# EAGLE design ac-adapter (EAGLE 9.6.2)
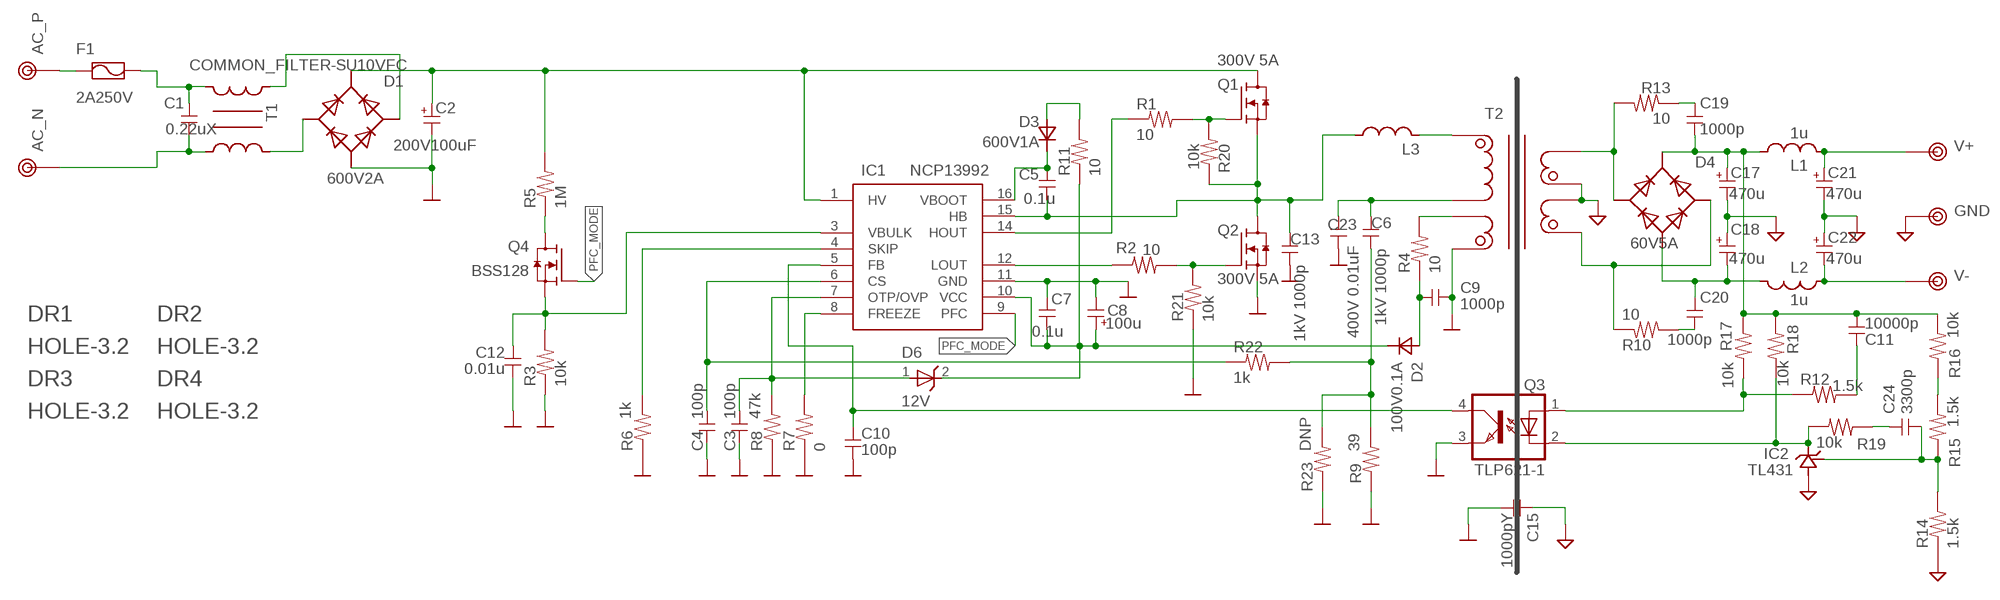
[diagram p0: schematic, sheet 1]

## Parts
C1  0.22uX  C-X  [X-CAPACITER]
C2  200V100uF  CPOLE7.5-16A2  [E5-16A2]
C3  100p  C-1608  [1608]
C4  100p  C-1608  [1608]
C5  0.1u  C-1608  [1608]
C6  1kV 1000p  C-5  [C050]
C7  0.1u  C-1608  [1608]
C8  100u  CPOLE2.5-6.5  [E2.5-6.5]
C9  1000p  C-1608  [1608]
C10  100p  C-1608  [1608]
C11  10000p  C-1608  [1608]
C12  0.01u  C-1608  [1608]
C13  1kV 1000p  C-5  [C050]
C15  1000pY  C-Y  [Y-CAPACITER]
C17  470u  CPOLE5-10  [E5-10]
C18  470u  CPOLE5-10  [E5-10]
C19  1000p  C-1608  [1608]
C20  1000p  C-1608  [1608]
C21  470u  CPOLE5-10  [E5-10]
C22  470u  CPOLE5-10  [E5-10]
C23  400V 0.01uF  C-12.5  [C125]
C24  3300p  C-1608  [1608]
D1  600V2A  DIODE4-GBU8A  [GBU8A]
D2  100V0.1A  DIODE-1N4148W  [SOD123]
D3  600V1A  DIODE-7  [D0204/7]
D4  60V5A  DIODE4-RBA406B  [RBA-406]
D6  12V  ZENER-SMD  [SOD123]
DR1  HOLE-3.2  [HOLE_3.2]
DR2  HOLE-3.2  [HOLE_3.2]
DR3  HOLE-3.2  [HOLE_3.2]
DR4  HOLE-3.2  [HOLE_3.2]
F1  2A250V  FUSE-5  [FUSE-5]
IC1  NCP13992  [SO16-NCP13992]
IC2  TL431  [TO-92]
L1  1u  L-5  [L5-7,5]
L2  1u  L-5  [L5-7,5]
L3  L-PQ20  [BPQ20/20]
Q1  300V 5A  NMOS  [TO-220]
Q2  300V 5A  NMOS  [TO-220]
Q3  TLP621-1  [DIL04]
Q4  BSS128  NMOS-SMD  [SC59]
R1  10  R-2012  [2012]
R2  10  R-2012  [2012]
R3  10k  R-1608  [1608]
R4  10  R-1608  [1608]
R5  1M  R-7.5  [0204/7]
R6  1k  R-1608  [1608]
R7  0  R-1608J  [1608-J]
R8  47k  R-1608  [1608]
R9  39  R-1608  [1608]
R10  10  R-2012  [2012]
R11  10  R-1608  [1608]
R12  1.5k  R-1608  [1608]
R13  10  R-2012  [2012]
R14  1.5k  R-1608  [1608]
R15  1.5k  R-1608  [1608]
R16  10k  R-1608  [1608]
R17  10k  R-1608  [1608]
R18  10k  R-1608  [1608]
R19  10k  R-1608  [1608]
R20  10k  R-1608  [1608]
R21  10k  R-1608  [1608]
R22  1k  R-1608  [1608]
R23  DNP  R-1608  [1608]
T1  COMMON_FILTER-SU10VFC  [SU10VFC]
T2  TRANSFORMAER_FLYBACK-PQ2620  [BPQ26/20-1112CPFR]
TP1  AC_P  TESTPIN-BIG  [TESTPIN-BIG]
TP2  AC_N  TESTPIN-BIG  [TESTPIN-BIG]
TP3  V+  TESTPIN-BIG  [TESTPIN-BIG]
TP4  V-  TESTPIN-BIG  [TESTPIN-BIG]
TP5  GND  TESTPIN-BIG  [TESTPIN-BIG]

## Nets
GND: C15.1 C17.- C18.+ C21.- C22.+ IC2.2(GND) R14.1 T2.9(L3_P) T2.10(L4_N) TP5.1
N$1: C1.1 F1.2 T1.2
N$2: Q1.1(G) R1.2 R20.1
N$3: C19.1 R13.1
N$4: D1.3(AC2) T1.1
N$5: D1.2(AC1) T1.4
N$6: R15.2 R16.1
N$7: C18.- C20.1 D4.4(V-) L2.2
N$8: C6.1 C23.1 T2.3(L1_N)
N$9: Q2.1(G) R2.1 R21.2
N$10: C20.2 R10.2
N$11: L3.6 T2.1(L1_P)
N$12: IC1.8(FREEZE) R7.2
N$13: C3.1 D6.1(A) IC1.7(OTP/OVP) R8.2
N$14: C4.1 IC1.6(CS) R22.1
N$15: IC1.4(SKIP) R6.2
N$16: IC1.14(HOUT) R1.1
N$17: IC1.12(LOUT) R2.2
N$18: C5.1 D3.2(K) IC1.16(VBOOT)
N$19: C12.1 IC1.3(VBULK) Q4.2(S) R3.2
N$20: C10.1 IC1.5(FB) Q3.4(COL)
N$21: Q4.3(D) R5.1
N$22: R4.2 T2.6(L2_N)
N$23: C11.1 R12.2
N$24: C9.1 D2.1(A) R4.1
N$25: D3.1(A) R11.2
N$26: C1.2 T1.3 TP2.1
N$27: C6.2 R9.2 R22.2 R23.2
N$29: IC2.3(OUT) Q3.2(C) R18.1 R19.1
N$32: C24.2 IC2.1(REF) R14.2 R15.1
N$33: C24.1 R19.2
N$34: Q3.1(A) R12.1 R17.2
N$35: D4.2(AC1) R13.2 T2.7(L3_N) T2.8(L3_N)
N$36: D4.3(AC2) R10.1 T2.11(L4_P) T2.12(L4_P)
N$37: F1.1 TP1.1
N$40: C11.2 C17.+ C19.2 D4.1(V+) L1.2 R16.2 R17.1 R18.2
PFC_MODE: IC1.9(PFC) Q4.1(G)
PGND: C2.- C3.2 C4.2 C7.2 C8.- C9.2 C10.2 C12.2 C13.2 C15.2 C23.2 D1.4(V-) IC1.11(GND) Q2.3(S) Q3.3(EMIT) R3.1 R6.1 R7.1 R8.1 R9.1 R21.1 R23.1 T2.5(L2_P)
SW: C5.2 C13.1 IC1.15(HB) L3.4 Q1.3(S) Q2.2(D) R20.2
V+: C21.+ L1.1 TP3.1
V-: C22.- L2.1 TP4.1
VCC: C7.1 C8.+ D2.2(K) D6.2(C) IC1.10(VCC) R11.1
VH: C2.+ D1.1(V+) IC1.1(HV) Q1.2(D) R5.2

## Library data of the parts
C1 C3-C7 C9-C13 C15 C19 C20 C23 C24 = my_rcl:C
C2 C8 C17 C18 C21 C22 = my_rcl:CPOL
D1 D4 = my_rcl:DIODE4
D2 D3 = my_rcl:DIODE
D6 = my_rcl:ZENER
DR1-DR4 = my_connector:HOLE-3.2
F1 = my_rcl:FUSE
IC1 = my_ic:NCP13992
IC2 = my_ic:TL431
L1-L3 = my_rcl:L
Q1 Q2 Q4 = my_ic:NMOS
Q3 = my_ic:TLP621-1: Photocoupler
R1-R23 = my_rcl:R
T1 = my_rcl:COMMON_FILTER
T2 = my_rcl:TRANSFORMAER_FLYBACK
TP1-TP5 = my_connector:TESTPIN

## Board
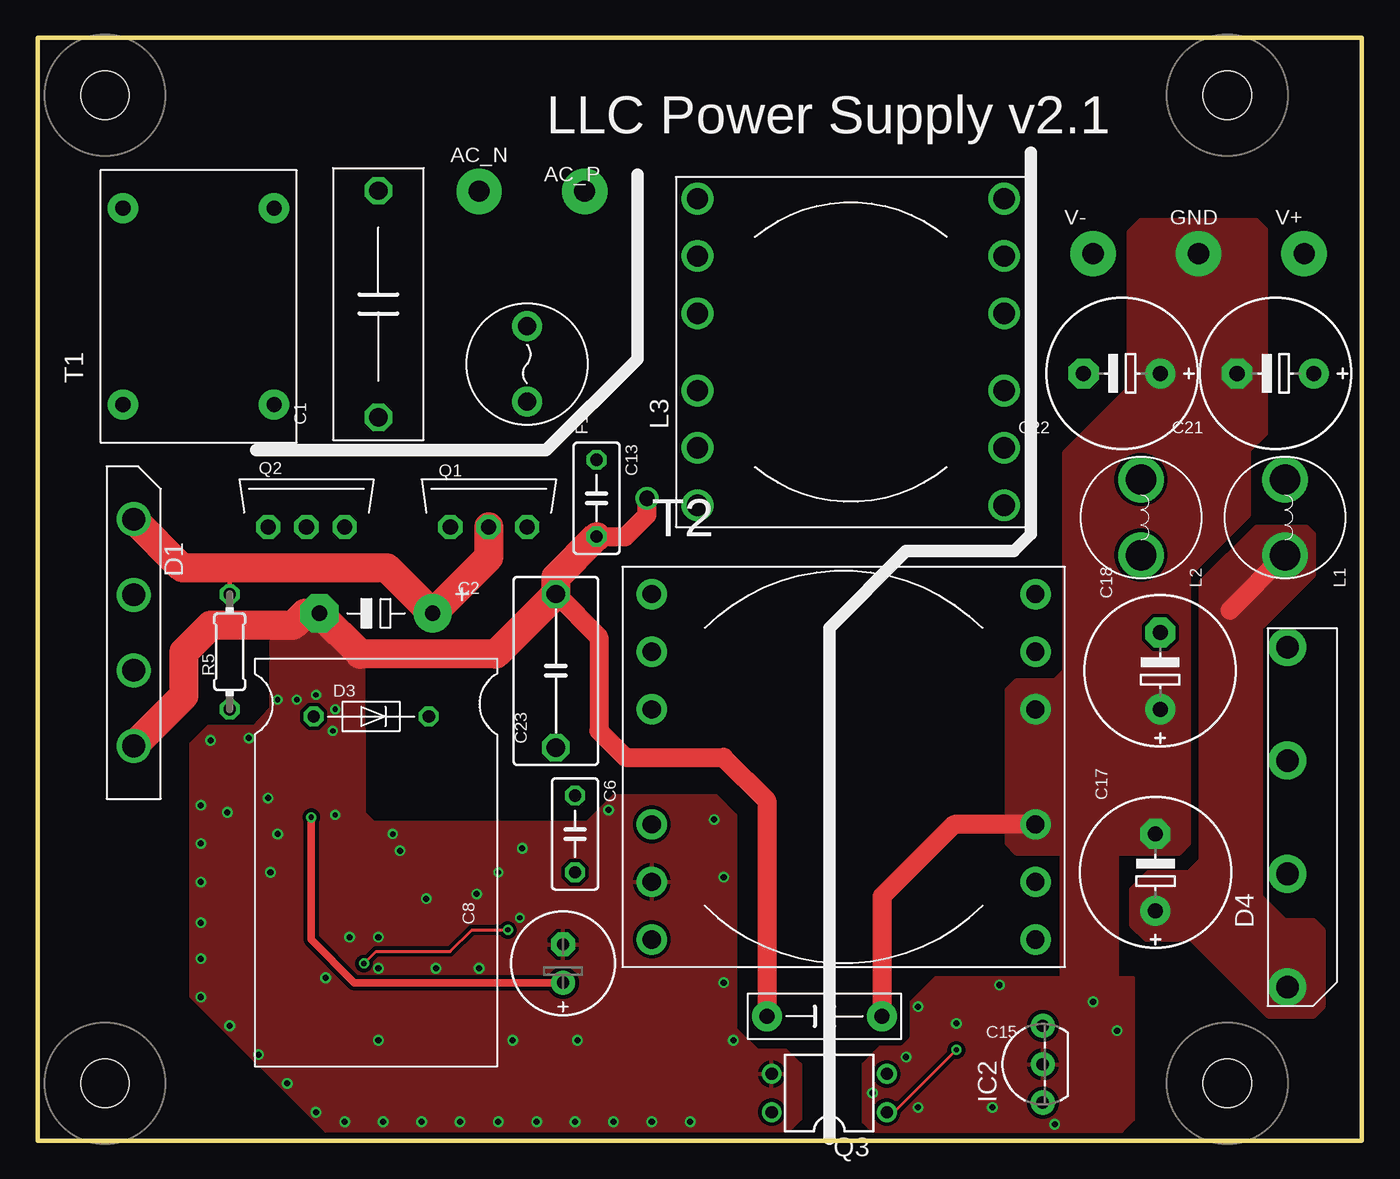
[diagram p1: board, top side]
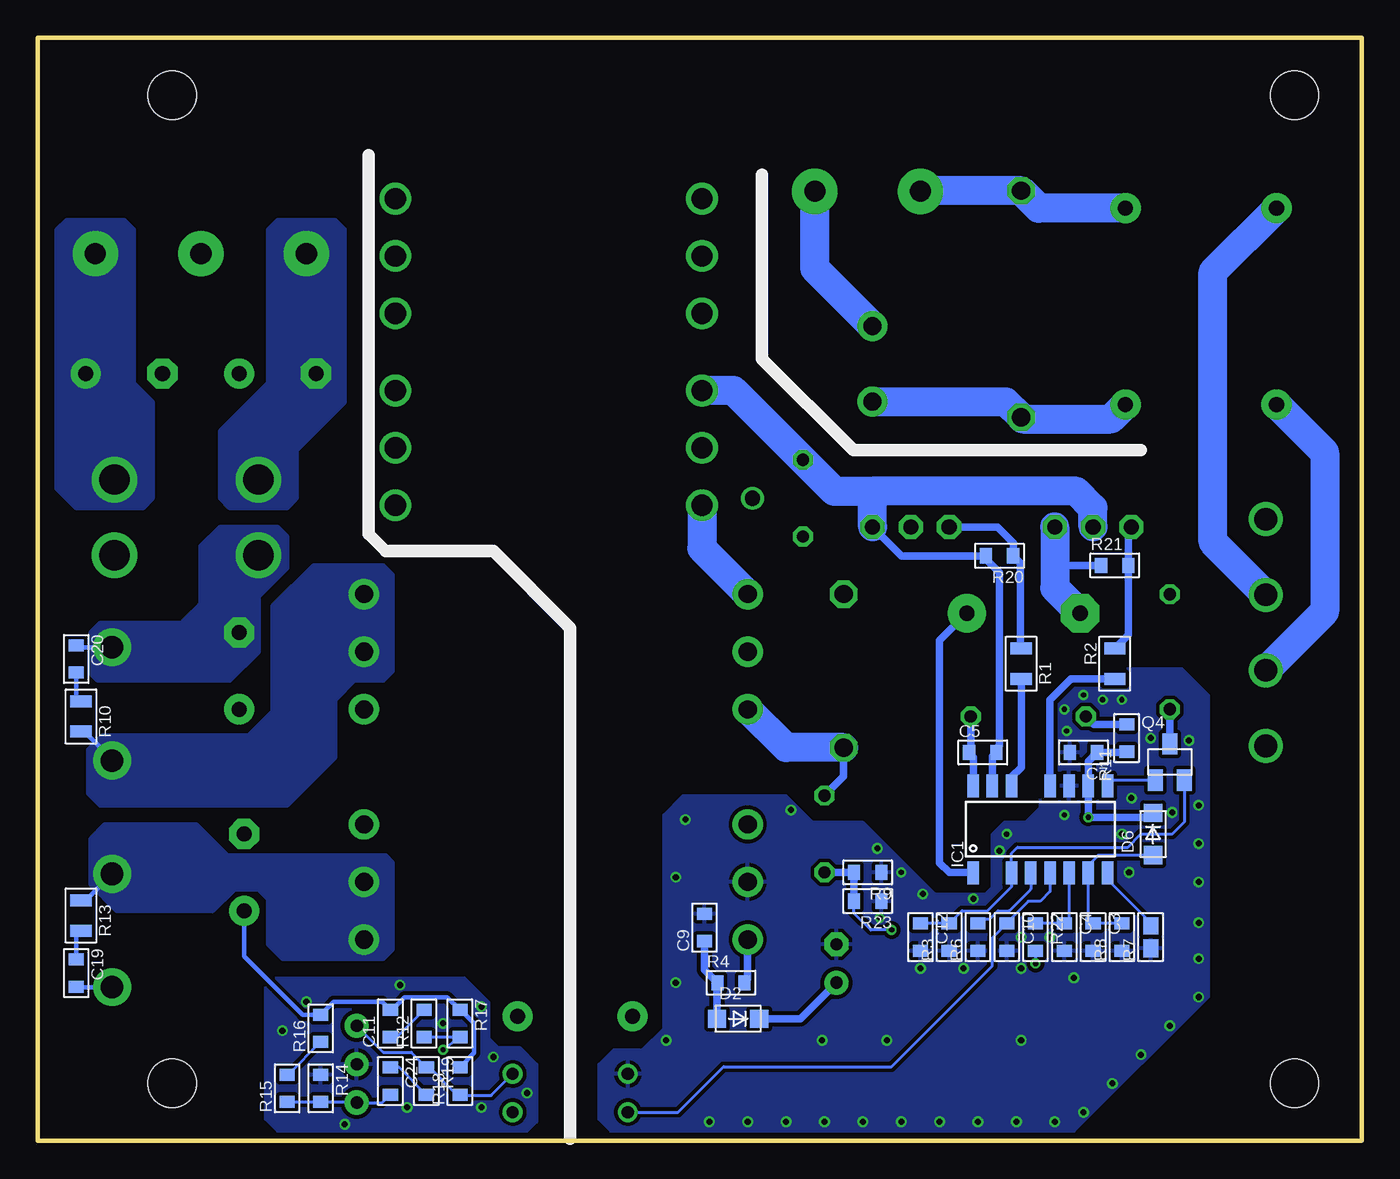
[diagram p2: board, bottom side, seen from below]

Size 87.63 x 73.03 mm. Coordinates in mm from the lower left corner, seen from the top.
Outline: 0,73.03 0,0 87.63,0 87.63,73.03 0,73.03
Copper layers (1*16): Top 0.035mm / dielectric 1.5mm / Bottom 0.035mm
Design rules "SeeedStudio_2layer_DRU_20140221 *": minimum track width 6mil, minimum drill 0.3mm, track to track 8mil, track to pad 8mil, pad to pad 8mil, via to via 12mil, smd to smd 0mil, copper to edge 0.3mm, drill to drill 10mil, minimum pad ring 0.25mm, minimum via ring 6mil, stop-mask expansion 2mil, vias tented up to drill 1mm, thermal gap 10mil
bRestrict: 1 lines

### Footprints (pad centres in the part's own frame; a part is rotated, then mirrored left to right if it is on the bottom)
X-CAPACITER = drill 1.2 octagon: 1 -7.5,0; 2 7.5,0
E5-16A2 = drill 1.016 pad 2.54: + 3.75,0 | drill 1.016 pad 2.54 octagon: - -3.75,0
1608 = smd 0.8 x 1: 1 -0.9,0; 2 0.9,0
C050 = drill 0.813 octagon: 1 -2.54,0; 2 2.54,0
E2.5-6.5 = drill 0.813 pad 1.6: + -1.27,0 | drill 0.813 pad 1.6 octagon: - 1.27,0
Y-CAPACITER = drill 1 pad 2: 1 -3.81,0; 2 3.81,0
E5-10 = drill 1 pad 2: + -2.54,0 | drill 1 pad 2 octagon: - 2.54,0
C125 = drill 1.2 octagon: 1 -5.08,0; 2 5.08,0
GBU8A = drill 1.5: 1 -7.5,0; 2 -2.5,0; 3 2.5,0; 4 7.5,0
SOD123 = smd 1.2 x 1.2: 1 -1.4,0; 2 1.4,0
D0204/7 = drill 0.813 octagon: 1 -3.81,0; 2 3.81,0
RBA-406 = drill 1.5 pad 2.5: 1 -11.25,0; 2 -3.75,0; 3 3.75,0; 4 11.25,0
HOLE_3.2 = hole 3.2: 0,0
FUSE-5 = drill 1.2 pad 2: 1 -2.5,0; 2 2.5,0
SO16-NCP13992 = smd 0.762 x 1.524: 1 -4.445,-2.875; 3 -1.905,-2.875; 4 -0.635,-2.875; 5 0.635,-2.875; 6 1.905,-2.875; 7 3.175,-2.875; 8 4.445,-2.875; 9 4.445,2.875; 10 3.175,2.875; 11 1.905,2.875; 12 0.635,2.875; 14 -1.905,2.875; 15 -3.175,2.875; 16 -4.445,2.875
TO-92 = drill 0.813 pad 1.6: 1 -2.54,0; 2 0,0; 3 2.54,0
L5-7,5 = drill 2 pad 3: 1 -2.5,0; 2 2.5,0
BPQ20/20 = drill 1.4: 1 -10.15,10.15; 2 -10.15,6.35; 3 -10.15,2.55; 4 -10.15,-2.55; 5 -10.15,-6.35; 6 -10.15,-10.15; 7 10.15,-10.15; 8 10.15,-6.35; 9 10.15,-2.55; 10 10.15,2.55; 11 10.15,6.35; 12 10.15,10.15
TO-220 = drill 1 pad 1.6 octagon: 1 -2.54,0; 2 0,0; 3 2.54,0
DIL04 = drill 0.813: 1 -1.27,-3.81; 2 1.27,-3.81; 3 1.27,3.81; 4 -1.27,3.81
SC59 = smd 1 x 1.4: 1 -0.95,-1.2; 2 0.95,-1.2; 3 0,1.2
2012 = smd 0.8 x 1.4: 1 -1,0; 2 1,0
0204/7 = drill 0.813 octagon: 1 -3.81,0; 2 3.81,0
1608-J = smd 1.2 x 1: 1 -0.75,0 | smd 1.1 x 1: 2 0.75,0
SU10VFC = drill 1 pad 2: 1 -6.5,5; 2 -6.5,-5; 3 6.5,-5; 4 6.5,5
BPQ26/20-1112CPFR = drill 1.2 pad 2: 1 -12.7,11.43; 2 -12.7,7.62; 3 -12.7,3.81; 4 -12.7,-3.81; 5 -12.7,-7.62; 6 -12.7,-11.43; 7 12.7,-11.43; 8 12.7,-7.62; 9 12.7,-3.81; 10 12.7,3.81; 11 12.7,7.62; 12 12.7,11.43
TESTPIN-BIG = drill 1.4 pad 3: 1 0,0

### Placement (x,y rotation side)
C1  22.54,55.4 90 top
C2  22.38,34.92 0 top
C3  17.78,13.49 270 bottom
C4  19.68,13.49 270 bottom
C5  25.08,25.72 0 bottom
C6  35.56,20.32 270 top
C7  18.41,25.72 180 bottom
C8  34.77,11.75 90 top
C9  43.5,14.13 90 bottom
C10  23.5,13.49 270 bottom
C11  64.29,7.78 90 bottom
C12  29.21,13.49 270 bottom
C13  36.99,42.55 270 top
C15  52.07,8.26 180 top
C17  73.98,17.78 90 top
C18  74.3,31.11 90 top
C19  85.09,11.11 270 bottom
C20  85.09,31.91 270 bottom
C21  81.92,50.8 180 top
C22  71.75,50.8 180 top
C23  34.29,31.11 90 top
C24  64.29,3.97 270 bottom
D1  6.35,33.66 270 top
D2  41.27,8.1 0 bottom
D3  22.07,28.1 0 top
D4  82.71,21.43 90 top
D6  13.81,20.32 90 bottom
DR1  4.45,69.22 0 top
DR2  4.45,3.81 0 top
DR3  78.74,3.81 0 top
DR4  78.74,69.22 0 top
F1  32.38,51.44 270 top
IC1  21.27,20.64 0 bottom
IC2  66.52,5.08 90 top
L1  82.55,41.27 270 top
L2  73.03,41.27 270 top
L3  53.82,52.23 0 top
Q1  29.84,40.64 0 top
Q2  17.78,40.64 0 top
Q3  52.39,3.17 90 top
Q4  12.7,25.08 0 bottom
R1  22.54,31.59 90 bottom
R2  16.35,31.59 270 bottom
R3  27.3,13.49 90 bottom
R4  41.75,10.48 0 bottom
R5  12.7,32.38 90 top
R6  25.4,13.49 90 bottom
R7  13.97,13.49 90 bottom
R8  15.88,13.49 90 bottom
R9  32.7,17.78 180 bottom
R10  84.77,28.1 90 bottom
R11  15.56,26.67 90 bottom
R12  62.07,7.78 90 bottom
R13  84.77,14.92 90 bottom
R14  68.9,3.49 270 bottom
R15  71.12,3.49 90 bottom
R16  68.9,7.46 90 bottom
R17  59.69,7.78 270 bottom
R18  59.69,3.97 90 bottom
R19  61.91,3.97 270 bottom
R20  23.97,38.73 180 bottom
R21  16.35,38.1 0 bottom
R22  21.59,13.49 270 bottom
R23  32.7,15.88 180 bottom
T1  10.64,55.24 90 top
T2  53.34,24.77 0 top
TP1  36.2,62.87 0 top
TP2  29.21,62.87 0 top
TP3  83.82,58.74 0 top
TP4  69.85,58.74 0 top
TP5  76.83,58.74 0 top

### Tracks (layer width: path | path; a pad name or v marks a point on that pad's centre or on a via)
GND  (via drill 0.4)
  Top 1.27: T2.9 60.64,20.95 55.88,16.19 C15.1
  other vias: 55.24,3.17 57.47,5.56 58.26,2.22 67.31,1.11 63.18,2.22 60.8,7.78 58.26,8.89 63.66,10.32 71.44,7.3 69.85,9.21
  pour Bottom (isolate 0.254): 57.78,9.21 57.78,6.83 57.15,6.19 55.72,6.19 54.61,5.08 54.61,1.27 55.24,0.64 71.75,0.64 72.55,1.43 72.55,10.32 72.07,10.79 59.37,10.79
  pour Top (isolate 0.254): 72.55,10.79 59.37,10.79 57.78,9.21 57.78,6.83 57.15,6.19 55.72,6.19 54.61,5.08 54.61,1.27 55.24,0.64 71.75,0.64 72.55,1.43
  pour Top (isolate 0.254, no thermals): 75.56,19.05 64.77,19.05 64.14,19.68 64.14,29.84 64.77,30.48 67.31,30.48 67.94,31.11 67.94,35.88 76.2,35.88 76.2,19.68
  pour Top (isolate 0.254, no thermals): 71.44,19.05 71.44,10.32 67.79,10.32 67.79,19.05
  pour Top (isolate 0.254, no thermals): 67.94,35.88 67.94,45.56 72.23,49.85 72.23,60.17 73.03,60.96 80.64,60.96 81.28,60.33 81.28,46.83 80.17,45.72 80.17,41.43 76.2,37.47 76.2,35.88
N$1
  Bottom 1.905: T1.2 16.59,47.79 22.43,47.79 C1.1 23.57,48.94 F1.2
N$2
  Bottom 0.508: Q1.1 24.13,40.64 23.07,39.58 R20.1 22.59,38.26 22.59,32.64 R1.2
N$3
  Bottom 0.305: R13.1 85.09,13.61 C19.1
N$4
  Bottom 1.905: T1.1 2.46,45.57 2.46,35.04 D1.3
N$5
  Bottom 1.905: D1.2 9.84,39.65 9.84,57.54 T1.4
N$6
  Bottom 0.203: R16.1 71.07,4.39 R15.2
N$7
  Bottom 0.305: D4.4 84.96,32.68 C20.1
  pour Bottom (isolate 0.254, no thermals): 83.66,30.48 74.93,30.48 73.03,32.38 73.03,36.04 71.12,37.94 71.12,40.01 71.75,40.64 75.56,40.64 76.83,39.37 76.83,35.56 78.11,34.29 83.5,34.29 84.14,33.66 84.14,30.96
N$8
  Bottom 0.508: C6.1 34.29,24.13 C23.1
  Bottom 1.905: C23.1 38.1,26.04 T2.3
N$9
  Bottom 0.508: Q2.1 15.45,40.43 R21.2 15.45,33.49 R2.1
N$10
  Bottom 0.305: C20.2 85.09,29.42 R10.2
N$11
  Bottom 1.905: L3.6 43.67,39.22 T2.1
N$12
  Bottom 0.203: IC1.8 16.83,17.3 13.97,14.45 R7.2
N$13
  Bottom 0.203: R8.2 C3.1 17.78,14.45 18.1,14.76 IC1.7 18.1,18.26 17.43,18.92 D6.1
N$14
  Bottom 0.203: IC1.6 19.37,14.61 19.58,14.39 C4.1 R22.1
N$15
  Bottom 0.203: R6.2 25.08,14.71 24.61,14.71 24.08,15.24 23.34,15.24 21.91,16.67 IC1.4
N$16
  Bottom 0.508: R1.1 22.54,24.72 23.18,24.08 IC1.14
N$17
  Bottom 0.508: IC1.12 20.64,29.21 19.26,30.59 R2.2
N$18
  Bottom 0.508: IC1.16 25.72,25.4 25.98,25.66 C5.1 25.88,25.82 D3.2
N$19
  Bottom 0.203: Q4.2 11.75,21.11 12.54,20.32 14.61,20.32 15.48,19.45 22.78,19.45 23.18,19.05 IC1.3 23.18,16.83 24.77,15.24 26.46,15.24 R3.2 C12.1
N$20
  Bottom 0.203: Q3.4 45.24,1.91 42.23,4.92 31.11,4.92 24.45,11.59 24.45,13.44 C10.1 23.5,14.45 22.07,15.88 21.27,15.88 20.64,16.51 IC1.5
N$21
  Bottom 0.508: Q4.3 R5.1
N$22
  Bottom 0.508: T2.6 40.64,10.69 R4.2
N$23
  Bottom 0.203: R12.2 63.87,6.88 C11.1
N$24
  Bottom 0.508: C9.1 43.5,11.32 R4.1 42.67,10.45 D2.1
N$25
  Bottom 0.508: R11.2 17.73,27.57 D3.1
N$26
  Bottom 1.905: T1.3 21.38,61.74 C1.2 28.85,62.9 28.89,62.87 TP2.1
N$27  (via drill 0.35)
  Top 0.203: v21.59,11.75 22.38,12.54 27.3,12.54 28.73,13.97 v31.11,13.97
  Bottom 0.203: R22.2 v21.59,11.75 | v31.11,13.97 32.49,13.97 33.6,15.08 R23.2
  Bottom 0.508: C6.2 R9.2 R23.2
N$29
  Bottom 0.203: IC2.3 64.77,5.87 62.92,5.87 R19.1 61.7,4.87 59.9,3.07 R18.1 59.64,3.02 57.63,3.02 Q3.2
N$32
  Bottom 0.203: C24.2 64.82,2.54 IC2.1 66.57,2.59 R14.2 R15.1
N$33
  Bottom 0.203: R19.2 63.71,4.87 C24.1
N$34  (via drill 0.35)
  Top 0.203: v60.8,6.03 56.67,1.91 Q3.1
  Bottom 0.203: R17.2 59.85,6.88 | 59.85,6.88 R12.1 | v60.8,6.03 60.7,6.03 59.85,6.88
N$35
  Bottom 0.305: D4.2 84.47,15.92 R13.2
  Bottom 1.27: T2.7 66.04,13.18 | 82.45,17.68 D4.2 82.45,17.94
  pour Bottom (isolate 0.254, no thermals): 75.09,18.89 64.61,18.89 64.14,18.41 64.14,12.7 64.77,12.06 71.44,12.06 72.39,13.02 72.39,16.03 73.03,16.67 74.61,16.67 76.04,15.24 82.39,15.24 84.14,16.99 84.14,20 83.19,20.95 77.15,20.95
N$36
  Bottom 0.305: R10.1 84.57,27.1 82.71,25.24 D4.3
  Bottom 1.27: T2.11 66.04,32.23
  pour Bottom (isolate 0.254, no thermals): 83.34,26.83 84.3,25.88 84.3,23.02 83.5,22.23 71.12,22.23 67.94,25.4 67.94,29.21 66.67,30.48 64.77,30.48 64.14,31.11 64.14,37.47 64.77,38.1 69.37,38.1 72.07,35.4 72.07,28.42 73.66,26.83
N$37
  Bottom 1.905: F1.1 36.2,57.74 TP1.1
N$40
  Top 1.27: 78.9,35.12 L1.2
  Bottom 0.203: 68.71,8.55 R16.2
  Bottom 0.305: 68.71,8.55 68.05,9.21 64.82,9.21 C11.2 64.19,8.68 63.34,9.53 60.54,9.53 R17.1 59.64,8.68 58.74,7.78 58.74,5.82 R18.2 | C17.+ 73.98,12.22 70.11,8.36 R16.2 | D4.1 85.06,10.18 C19.2
  pour Top (isolate 0.254, no thermals): 76.2,17.78 73.5,17.78 72.39,16.67 72.39,14.29 73.34,13.34 76.36,13.34 81.44,8.26 84.45,8.26 85.09,8.89 85.09,13.97 84.45,14.61 82.55,14.61 80.96,16.19 80.96,33.97 84.45,37.47 84.45,40.16 83.98,40.64 80.64,40.64 76.99,36.99 76.99,18.57
PFC_MODE
  Bottom 0.203: Q4.1 16.46,23.88 IC1.9
PGND  (via drill 0.35, 0.4, 1)
  Top 1.27: C15.2 48.26,22.54 45.4,25.4 38.89,25.4 37.15,27.15 37.15,33.34 C23.2 | C13.2 38.89,40.01 40.32,41.43 v40.32,42.55
  Top 1.905: D1.4 9.68,29.49 9.68,32.38 11.43,34.13 16.89,34.13 17.68,34.92 C2.- 21.33,32.23 30.32,32.23 C23.2 34.29,37.31 C13.2
  Bottom 0.508: R21.1 20.32,38.1
  Bottom 1.27: Q2.3 20.32,38.1 20.32,36.61
  Bottom 1.905: Q2.3 20.32,36.61 C2.-
  other vias: 15.88,29.21 17.14,29.21 18.41,29.53 19.68,28.57 19.53,27.15 19.68,21.59 23.5,20.32 23.97,19.21 29.05,16.35 22.54,11.43 19.05,10.79 26.35,11.43 20.64,13.49 15.4,17.78 15.88,20.32 15.24,22.7 12.54,21.75 13.97,26.67 11.43,26.51 10.79,22.23 10.79,19.68 10.79,17.14 10.79,14.45 10.79,12.06 10.79,9.53 12.7,7.62 14.61,5.71 16.51,3.81 18.41,1.91 20.32,1.27 22.86,1.27 25.4,1.27 27.94,1.27 30.48,1.27 33.02,1.27 35.56,1.27 38.1,1.27 40.64,1.27 43.18,1.27 46.04,6.67 45.4,10.48 44.77,21.27 32.07,19.37 37.78,21.91 45.4,17.46 22.54,6.67 31.43,6.67 35.72,6.67 22.54,13.49 29.21,11.43 25.72,16.03 31.91,14.76 30.48,17.78
  pour Top (isolate 0.254): 46.2,21.59 46.2,7.46 47.62,6.03 49.53,6.03 50.48,5.08 50.48,1.43 49.69,0.64 19.05,0.64 10.16,9.53 10.16,26.35 11.27,27.46 14.32,27.46 16.61,30 18.89,30 21.59,27.3 21.59,21.75 22.23,21.11 36.35,21.11 38.1,22.86 44.93,22.86
  pour Top (isolate 0.254, no thermals): 21.59,27.15 21.59,32.54 19.37,34.77 15.4,34.77 15.4,27.15
  pour Bottom (isolate 0.254): 11.91,31.27 10.16,29.53 10.16,9.53 19.05,0.64 49.69,0.64 50.48,1.43 50.48,5.08 49.53,6.03 47.62,6.03 46.2,7.46 46.2,21.59 44.93,22.86 38.1,22.86 36.35,21.11 33.02,21.11 28.26,16.35 24.92,16.35 24.45,16.83 24.45,20.32 23.65,21.11 22.23,21.11 21.27,22.07 21.27,28.42 18.41,31.27
SW
  Bottom 0.508: Q1.3 30.48,38.73 R20.2 24.87,38.52 23.97,37.62 23.97,26.19 24.29,25.88 24.29,25.82 C5.2 24.45,25.45 IC1.15
  Bottom 1.905: Q2.2 17.78,41.91 18.89,43.02 32.38,43.02 | Q1.3 32.38,43.02 | 32.38,43.02 34.92,43.02 C13.1 41.58,49.68 L3.4
V+
  pour Bottom (isolate 0.254, no thermals): 85.09,41.91 80.64,41.91 80.01,42.55 80.01,48.9 81.28,50.16 81.28,60.33 81.92,60.96 85.72,60.96 86.36,60.33 86.36,43.18
V-
  pour Bottom (isolate 0.254, no thermals): 74.93,41.91 71.12,41.91 70.48,42.55 70.48,45.72 67.31,48.9 67.31,60.33 67.94,60.96 71.75,60.96 72.39,60.33 72.39,50.16 75.56,46.99 75.56,42.55
VCC  (via drill 0.35)
  Top 0.508: v18.1,21.43 18.1,13.34 20.95,10.48 C8.+
  Bottom 0.508: R11.1 15.66,25.77 15.72,25.72 C7.1 18.1,25.14 IC1.10 v18.1,21.43 14.1,21.43 D6.2 | C8.+ 37.15,8.1 D2.2
VH
  Top 0.305: R5.2 12.7,37.94
  Top 1.905: Q1.2 29.84,38.64 C2.+ 23.12,37.94 12.7,37.94 9.56,37.94 D1.1
  Bottom 0.508: C2.+ 27.94,33.12 27.94,18.41 27.3,17.78 25.73,17.78 IC1.1

### Text on the board
tPlace: LLC Power Supply v2.1